# Altium schematic sheet LINPOL12.SchDoc: LINPOL12
size A portrait; CheckedBy: Panagiotis Gkountoumis; DocumentNumber: 3; SheetNumber: 3; SheetTotal: 4
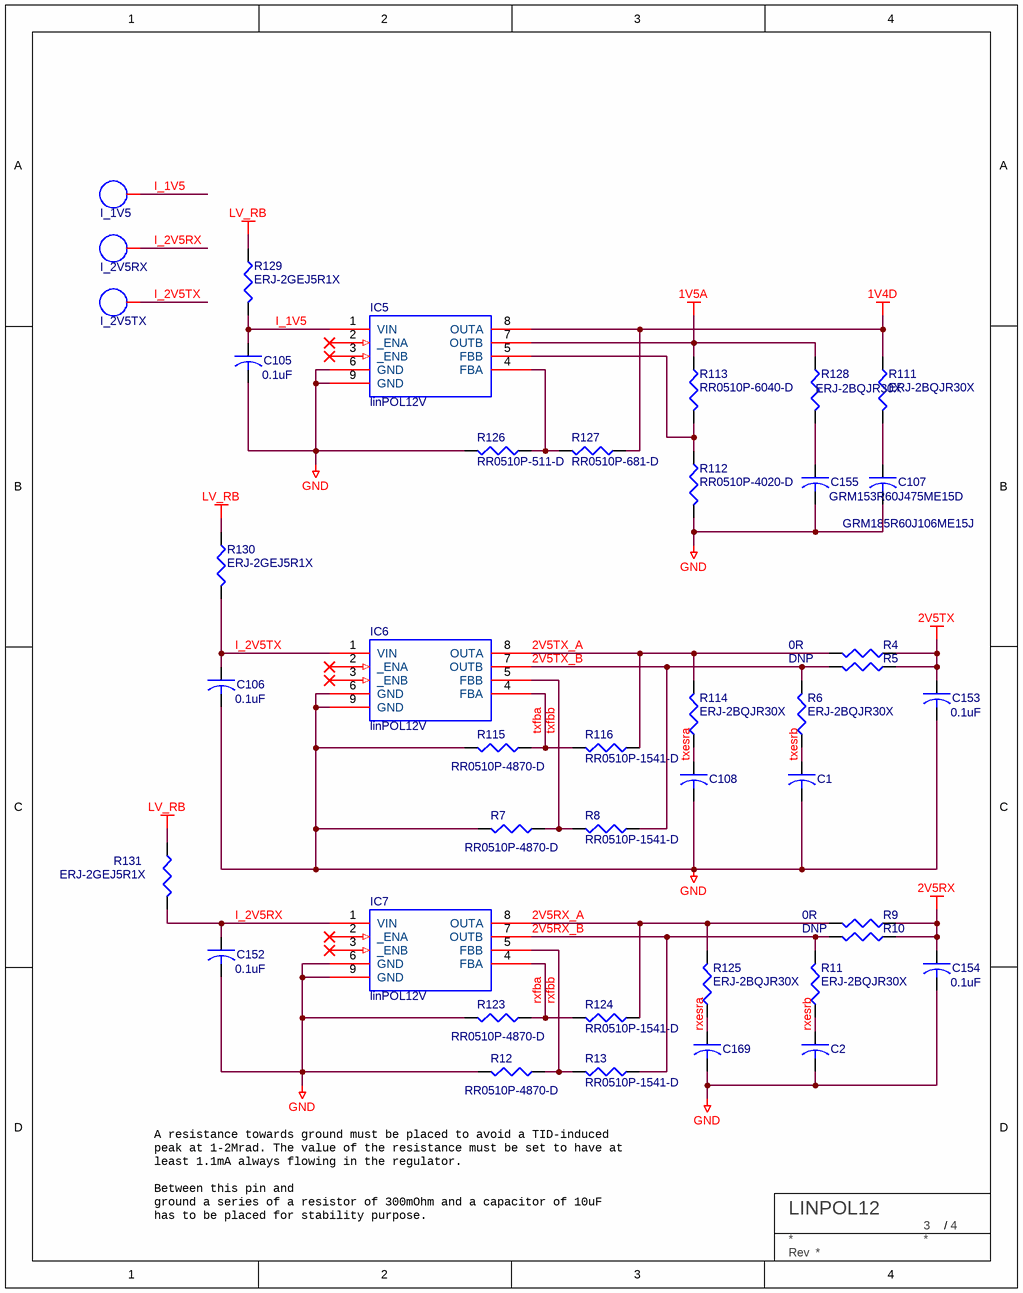
[diagram p0: LINPOL12.SchDoc]

## Parts
C1  GRM185R60J106ME15J  [CAPC1608N]  (value not drawn)
C2  GRM185R60J106ME15J  [CAPC1608N]  (value not drawn)
C105  value 0.1uF  [capc1005n]  (hidden comment: GRM155R71E104ME14D)
C106  value 0.1uF  [capc1005n]  (hidden comment: GRM155R71E104ME14D)
C107  GRM185R60J106ME15J  [CAPC1608N]
C108  GRM185R60J106ME15J  [CAPC1608N]  (value not drawn)
C152  value 0.1uF  [capc1005n]  (hidden comment: GRM155R71E104ME14D)
C153  value 0.1uF  [capc1005n]  (hidden comment: GRM155R71E104ME14D)
C154  value 0.1uF  [capc1005n]  (hidden comment: GRM155R71E104ME14D)
C155  GRM153R60J475ME15D  [capc1005n]
C169  GRM185R60J106ME15J  [CAPC1608N]  (value not drawn)
IC5  linPOL12V  [WDFNX208]
IC6  linPOL12V  [WDFNX208]
IC7  linPOL12V  [WDFNX208]
R4  0R  [R0805]
R5  DNP  [R0805]
R6  ERJ-2BQJR30X  [resc1005n]
R7  RR0510P-4870-D  [resc1005n]
R8  RR0510P-1541-D  [resc1005n]
R9  0R  [R0805]
R10  DNP  [R0805]
R11  ERJ-2BQJR30X  [resc1005n]
R12  RR0510P-4870-D  [resc1005n]
R13  RR0510P-1541-D  [resc1005n]
R111  ERJ-2BQJR30X  [resc1005n]
R112  RR0510P-4020-D  [resc1005n]
R113  RR0510P-6040-D  [resc1005n]
R114  ERJ-2BQJR30X  [resc1005n]
R115  RR0510P-4870-D  [resc1005n]
R116  RR0510P-1541-D  [resc1005n]
R123  RR0510P-4870-D  [resc1005n]
R124  RR0510P-1541-D  [resc1005n]
R125  ERJ-2BQJR30X  [resc1005n]
R126  RR0510P-511-D  [resc1005n]
R127  RR0510P-681-D  [resc1005n]
R128  ERJ-2BQJR30X  [resc1005n]
R129  ERJ-2GEJ5R1X  [resc1005n]
R130  ERJ-2GEJ5R1X  [resc1005n]
R131  ERJ-2GEJ5R1X  [resc1005n]
TBLOCK?  BU Title block  (value not drawn)  (graphical)
TP15  I_1V5  [testpoint]  (no BOM)
TP16  I_2V5RX  [testpoint]  (no BOM)
TP17  I_2V5TX  [testpoint]  (no BOM)

## Nets
1V4D: IC5.8(OUTA) R111.1 R127.1
1V5A: IC5.7(OUTB) R113.1 R128.1
2V5RX: C154.1 R9.1 R10.1
2V5TX: C153.1 R4.1 R5.1
GND: C1.2 C2.2 C105.2 C106.2 C107.2 C108.2 C152.2 C153.2 C154.2 C155.2 C169.2 IC5.6(GND) IC5.9(GND) IC6.6(GND) IC6.9(GND) IC7.6(GND) IC7.9(GND) R7.2 R12.2 R112.2 R115.2 R123.2 R126.2
LV_RB: R129.1 R130.1 R131.1
2V5RX_A: IC7.8(OUTA) R9.2 R124.1 R125.2
2V5RX_B: IC7.7(OUTB) R10.2 R11.2 R13.1
2V5TX_A: IC6.8(OUTA) R4.2 R114.2 R116.1
2V5TX_B: IC6.7(OUTB) R5.2 R6.2 R8.1
I_1V5: C105.1 IC5.1(VIN) R129.2 TP15.1(TP)
I_2V5RX: C152.1 IC7.1(VIN) R131.2 TP16.1(TP)
I_2V5TX: C106.1 IC6.1(VIN) R130.2 TP17.1(TP)
rxesra: C169.1 R125.1
rxesrb: C2.1 R11.1
rxfba: IC7.4(FBA) R123.1 R124.2
rxfbb: IC7.5(FBB) R12.1 R13.2
txesra: C108.1 R114.1
txesrb: C1.1 R6.1
txfba: IC6.4(FBA) R115.1 R116.2
txfbb: IC6.5(FBB) R7.1 R8.2
NetC107_1: C107.1 R111.2
NetC155_1: C155.1 R128.2
NetIC5_4: IC5.4(FBA) R126.1 R127.2
NetIC5_5: IC5.5(FBB) R112.1 R113.2

Not connected (* = marked no-connect by the designer): IC5 2(_ENA)* 3(_ENB)*; IC6 2(_ENA)* 3(_ENB)*; IC7 2(_ENA)* 3(_ENB)*

## Notes on the sheet
- A resistance towards ground must be placed to avoid a TID-induced peak at 1-2Mrad. The value of the resistance must be set to have at least 1.1mA always flowing in the regulator.
  Between this pin and
  ground a series of a resistor of 300mOhm and a capacitor of 10uF
  has to be placed for stability purpose.
- (in symbol TITLE_BLOCK_BU) /; Rev

## Library data of the parts
C1 C2 C107 C108 C169 = C: CERAMIC CAPACITOR; VALUE: 10uF
C105 C106 C152-C154 = C: CERAMIC CAPACITOR
C155 = C: CERAMIC CAPACITOR; VALUE: 4.7uF
R4-R13 R111-R116 R123-R131 = R1: FILM RESISTOR; Text Field2: 1%
TBLOCK? = TITLE_BLOCK_BU
TP15-TP17 = TP: TEST POINT 40MIL DIA.